# EAGLE schematic Diff-Single_converter (EAGLE 9.5.2)
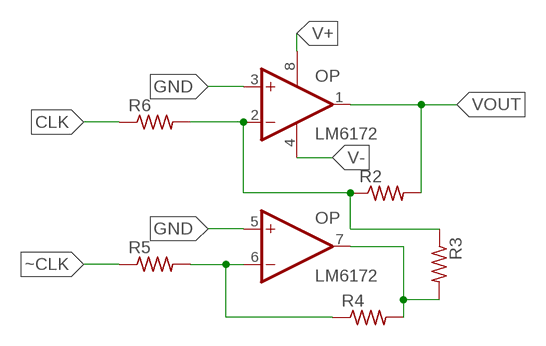
[diagram p0: schematic, sheet 1]

## Parts
OP  LM6172  [SOIC127P599X175-8N]
R2  R-US_R1206  [R1206]
R3  R-US_R1206  [R1206]
R4  R-US_R1206  [R1206]
R5  R-US_R1206  [R1206]
R6  R-US_R1206  [R1206]

## Nets
CLK: R6.1
GND: OP.3(+IN) OP.5(+IN1)
N$1: OP.2(-IN) R2.1 R3.1 R6.2
N$8: OP.6(-IN1) R4.1 R5.2
N$10: OP.7(OUT1) R3.2 R4.2
V+: OP.8(V+)
V-: OP.4(V-)
VOUT: OP.1(OUT) R2.2
~CLK: R5.1

## Library data of the parts
OP = LM6172:LM6172
R2-R6 = rcl:R-US_: RESISTOR, American symbol; SPICEPREFIX: R